# EAGLE design snappergps_1_0_0 (EAGLE 9.6.2)
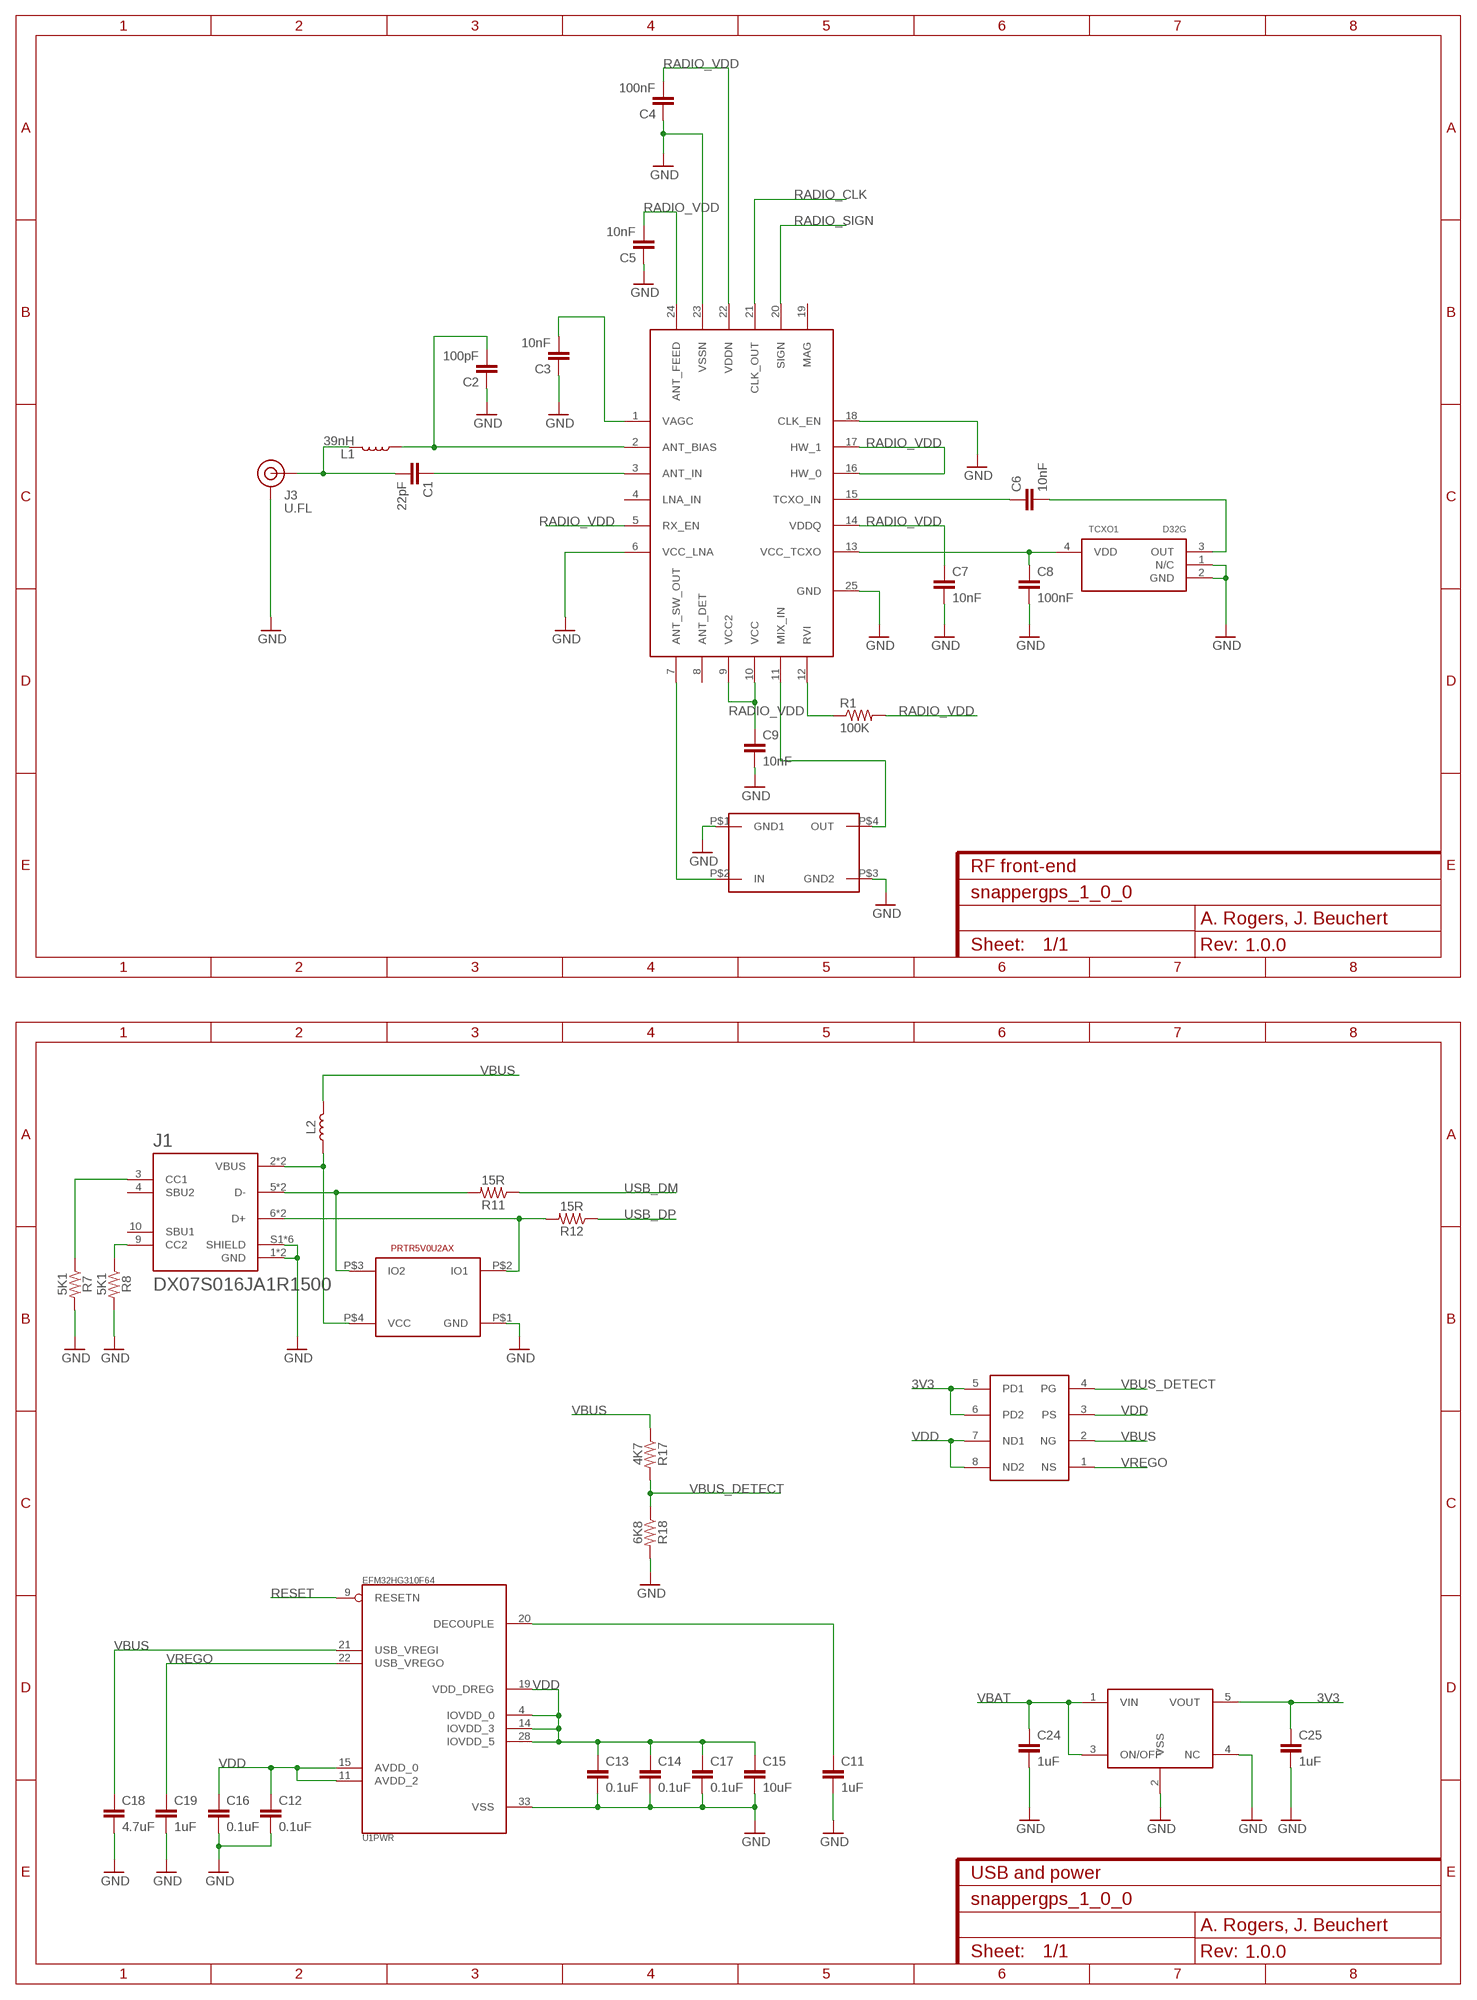
[diagram p0: schematic, sheet 1, part 1 of 2]
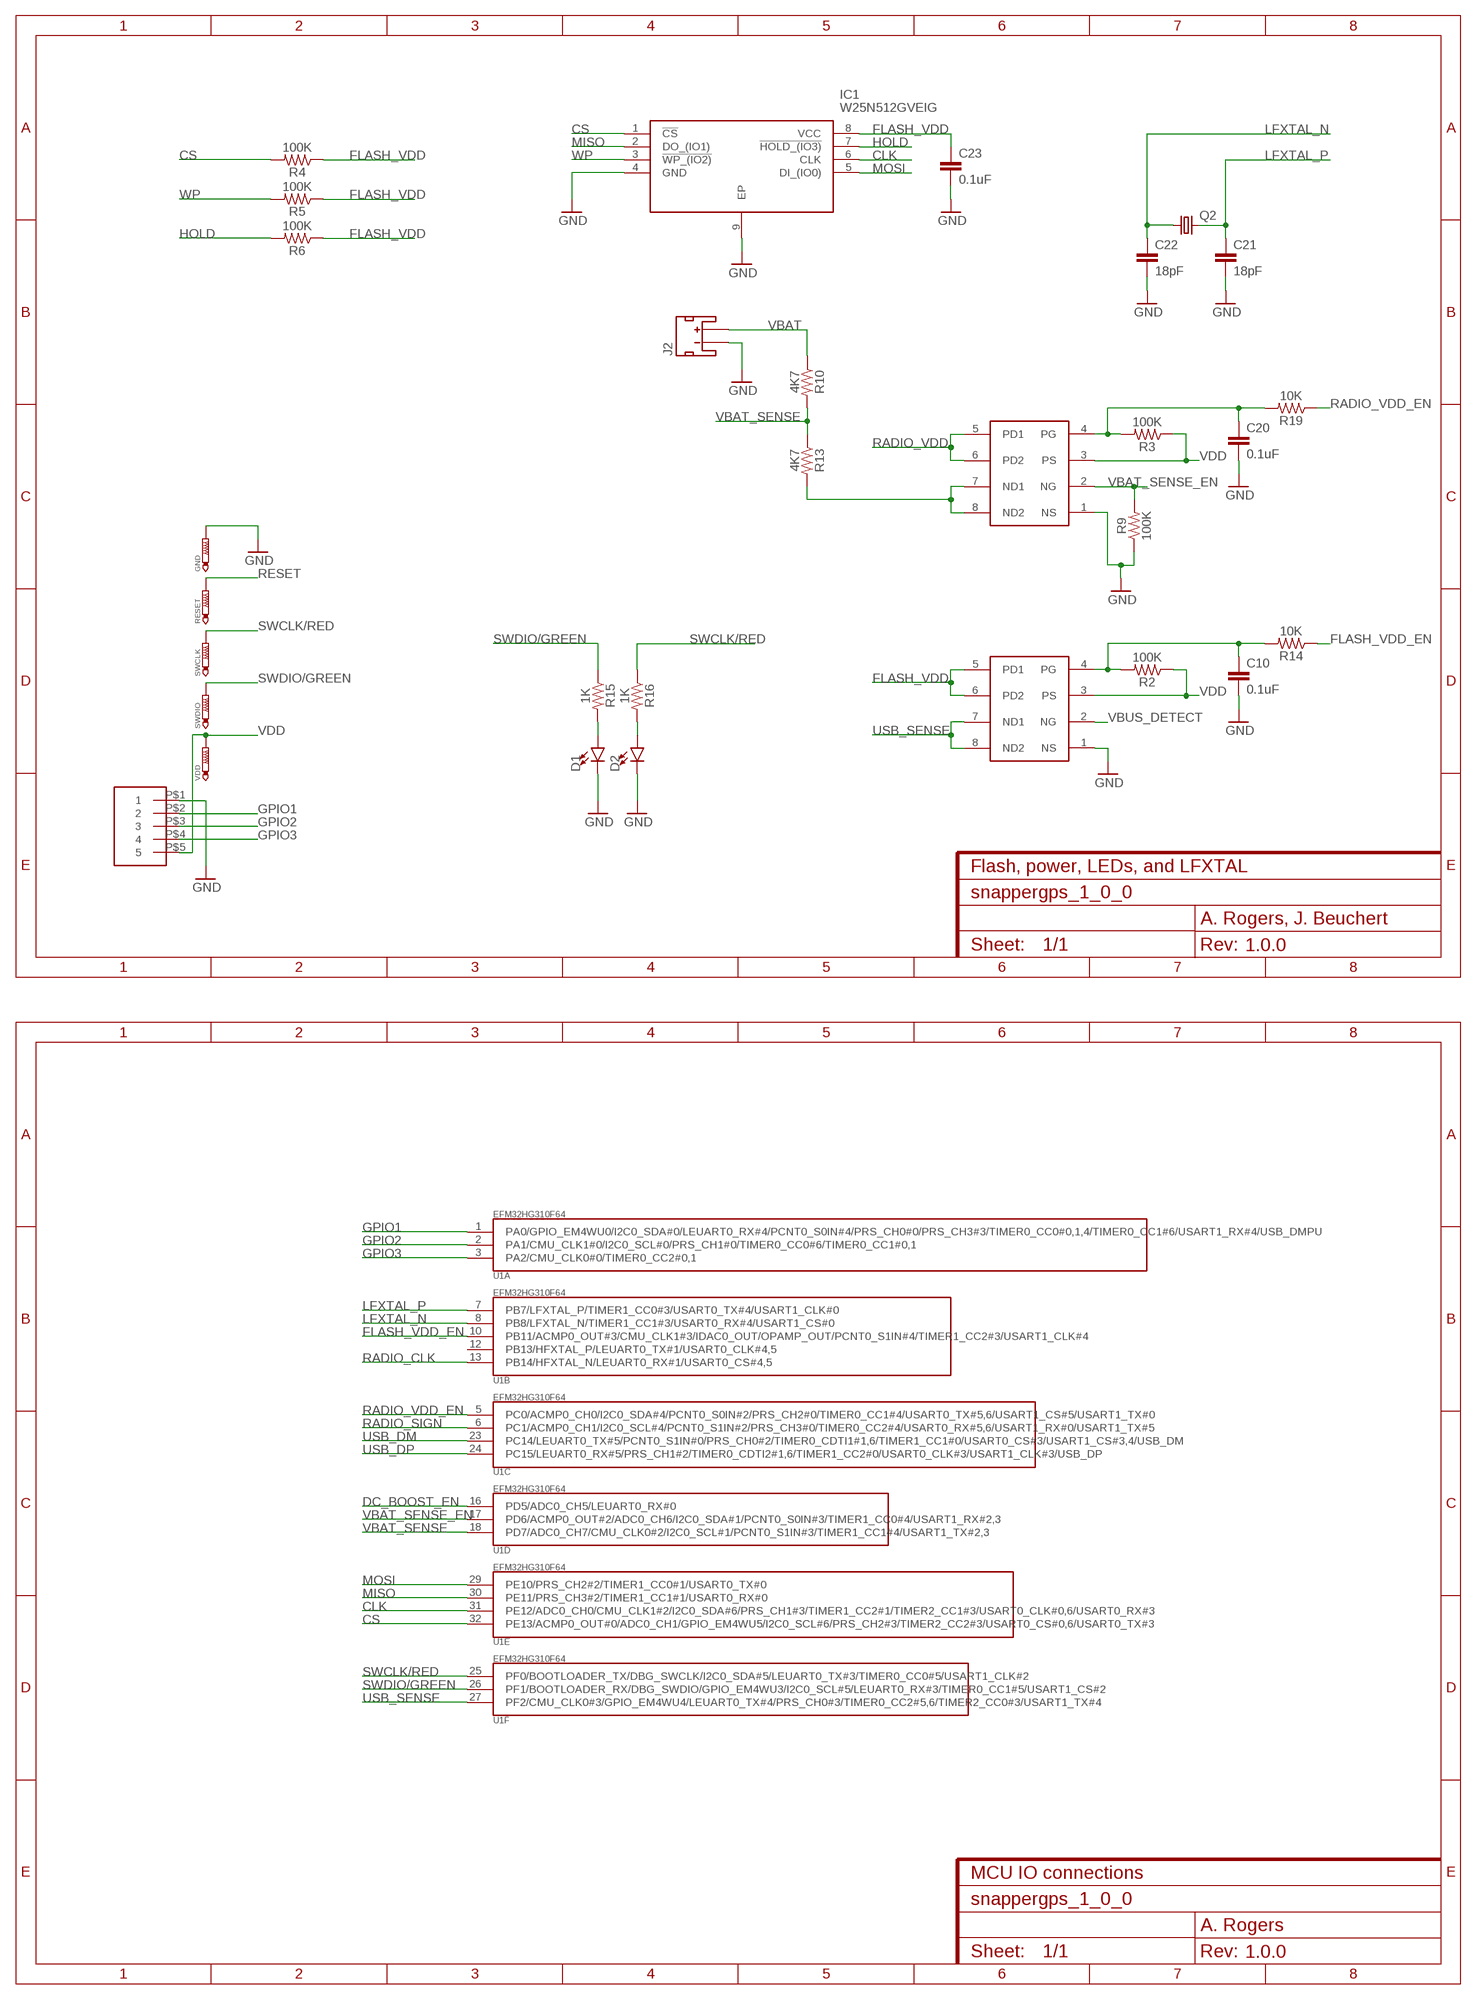
[diagram p1: schematic, sheet 1, part 2 of 2]
FRAME1 (FRAME-A4L): CNAME: RF front-end; CREVISION: 1.0.0; DESIGNER: A. Rogers, J. Beuchert; REV: 1.0.0
FRAME2 (FRAME-A4L): CNAME: Flash, power, LEDs, and LFXTAL; CREVISION: 1.0.0; DESIGNER: A. Rogers, J. Beuchert
FRAME3 (FRAME-A4L): CNAME: USB and power; CREVISION: 1.0.0; DESIGNER: A. Rogers, J. Beuchert
FRAME4 (FRAME-A4L): CNAME: MCU IO connections; CREVISION: 1.0.0; DESIGNER: A. Rogers

## Parts
C1  22pF  CAPACITOR_0402  [0402]
C2  100pF  CAPACITOR_0402  [0402]
C3  10nF  CAPACITOR_0402  [0402]
C4  100nF  CAPACITOR_0402  [0402]
C5  10nF  CAPACITOR_0402  [0402]
C6  10nF  CAPACITOR_0402  [0402]
C7  10nF  CAPACITOR_0402  [0402]
C8  100nF  CAPACITOR_0402  [0402]
C9  10nF  CAPACITOR_0402  [0402]
C10  0.1uF  CAPACITOR_0402  [0402]
C11  1uF  CAPACITOR_0603  [0603]
C12  0.1uF  CAPACITOR_0402  [0402]
C13  0.1uF  CAPACITOR_0402  [0402]
C14  0.1uF  CAPACITOR_0402  [0402]
C15  10uF  CAPACITOR_0603  [0603]
C16  0.1uF  CAPACITOR_0402  [0402]
C17  0.1uF  CAPACITOR_0402  [0402]
C18  4.7uF  CAPACITOR_0603  [0603]
C19  1uF  CAPACITOR_0603  [0603]
C20  0.1uF  CAPACITOR_0402  [0402]
C21  18pF  CAPACITOR_0402  [0402]
C22  18pF  CAPACITOR_0402  [0402]
C23  0.1uF  CAPACITOR_0402  [0402]
C24  1uF  CAPACITOR_0603  [0603]
C25  1uF  CAPACITOR_0603  [0603]
D1  LED0603  [LED-0603]
D2  LED0603  [LED-0603]
GND  PTR1B1,27  [B1,27]
IC1  W25N512GVEIG  [SON127P800X600X80-9N]
J1  DX07S016JA1R1500  [JAE_DX07S016JA1R1500]
J2  JST_2MM_MALE  [JST-2-SMD]
J3  U.FL  UFL-CONNECTOR  [U.FL]
L1  39nH  INDUCTOR  [0402]
L2  INDUCTOR  [0402]
Q1  TT8M1TRAMANDA  [AMANDA_TSST8]
Q2  CRYSTAL_JTX310  [3.2X1.5]
Q3  TT8M1TRAMANDA  [AMANDA_TSST8]
Q4  TT8M1TRAMANDA  [AMANDA_TSST8]
R1  100K  RESISTOR_0402  [0402]
R2  100K  RESISTOR_0402  [0402]
R3  100K  RESISTOR_0402  [0402]
R4  100K  RESISTOR_0402  [0402]
R5  100K  RESISTOR_0402  [0402]
R6  100K  RESISTOR_0402  [0402]
R7  5K1  RESISTOR_0402  [0402]
R8  5K1  RESISTOR_0402  [0402]
R9  100K  RESISTOR_0402  [0402]
R10  4K7  RESISTOR_0402  [0402]
R11  15R  RESISTOR_0402  [0402]
R12  15R  RESISTOR_0402  [0402]
R13  4K7  RESISTOR_0402  [0402]
R14  10K  RESISTOR_0402  [0402]
R15  1K  RESISTOR_0402  [0402]
R16  1K  RESISTOR_0402  [0402]
R17  4K7  RESISTOR_0402  [0402]
R18  6K8  RESISTOR_0402  [0402]
R19  10K  RESISTOR_0402  [0402]
RESET  PTR1B1,27  [B1,27]
SAW1  SAW_FILTER  [SAW_FILTER]
SWCLK  PTR1B1,27  [B1,27]
SWDIO  PTR1B1,27  [B1,27]
TCXO1  D32G  [D32G]
U1  EFM32HG310F64  [QFN32]
U2  RF_CIRCUIT-SE4150L  [QFN50P400X400X90-25N]
U3  TVS_DIODE-PRTR5V0U2AX  [TVS_DIODE-PRTR5V0U2AX]
U4  S-1318D33-M5T1U4  [SOT95P280X145-5N]
U5  ALEX_CONN5  [ALEX_CONN5]
VDD  PTR1B1,27  [B1,27]

## Nets
3V3: C25.1 Q4.5(PD1) Q4.6(PD2) U4.5(VOUT)
CLK: IC1.6(CLK) U1.31(E:PE12/ADC0_CH0/CMU_CLK1#2/I2C0_SDA#6/PRS_CH1#3/TIMER1_CC2#1/TIMER2_CC1#3/USART0_CLK#0,6/USART0_RX#3)
CS: IC1.1(!CS) R4.2 U1.32(E:PE13/ACMP0_OUT#0/ADC0_CH1/GPIO_EM4WU5/I2C0_SCL#6/PRS_CH2#3/TIMER2_CC2#3/USART0_CS#0,6/USART0_TX#3)
DC_BOOST_EN: U1.16(D:PD5/ADC0_CH5/LEUART0_RX#0)
FLASH_VDD: C23.1 IC1.8(VCC) Q3.5(PD1) Q3.6(PD2) R4.1 R5.1 R6.1
FLASH_VDD_EN: R14.1 U1.10(B:PB11/ACMP0_OUT#3/CMU_CLK1#3/IDAC0_OUT/OPAMP_OUT/PCNT0_S1IN#4/TIMER1_CC2#3/USART1_CLK#4)
GND: C2.1 C3.1 C4.1 C5.1 C7.2 C8.2 C9.2 C10.2 C11.2 C12.2 C13.2 C14.2 C15.2 C16.2 C17.2 C18.2 C19.2 C20.2 C21.2 C22.2 C23.2 C24.2 C25.2 D1.C D2.C GND.TP IC1.4(GND) IC1.9(EP) J1.1(GND) J1.12(GND) J1.S1(SHIELD) J1.S2(SHIELD) J1.S3(SHIELD) J1.S4(SHIELD) J1.S5(SHIELD) J1.S6(SHIELD) J2.1(-) J3.1(GND) J3.2(GND) Q1.1(NS) Q3.1(NS) R7.2 R8.2 R9.1 R18.2 SAW1.P$1(GND1) SAW1.P$3(GND2) TCXO1.1(N/C) TCXO1.2(GND) U1.33(PWR:VSS) U2.6(VCC_LNA) U2.18(CLK_EN) U2.23(VSSN) U2.25(GND) U3.P$1(GND) U4.2(VSS) U4.4(NC) U5.P$1
GPIO1: U1.1(A:PA0/GPIO_EM4WU0/I2C0_SDA#0/LEUART0_RX#4/PCNT0_S0IN#4/PRS_CH0#0/PRS_CH3#3/TIMER0_CC0#0,1,4/TIMER0_CC1#6/USART1_RX#4/USB_DMPU) U5.P$2
GPIO2: U1.2(A:PA1/CMU_CLK1#0/I2C0_SCL#0/PRS_CH1#0/TIMER0_CC0#6/TIMER0_CC1#0,1) U5.P$3
GPIO3: U1.3(A:PA2/CMU_CLK0#0/TIMER0_CC2#0,1) U5.P$4
HOLD: IC1.7(!HOLD_(IO3)) R6.2
LFXTAL_N: C22.1 Q2.1 U1.8(B:PB8/LFXTAL_N/TIMER1_CC1#3/USART0_RX#4/USART1_CS#0)
LFXTAL_P: C21.1 Q2.2 U1.7(B:PB7/LFXTAL_P/TIMER1_CC0#3/USART0_TX#4/USART1_CLK#0)
MISO: IC1.2(DO_(IO1)) U1.30(E:PE11/PRS_CH3#2/TIMER1_CC1#1/USART0_RX#0)
MIXIN [rf]: SAW1.P$4(OUT) U2.11(MIX_IN)
MOSI: IC1.5(DI_(IO0)) U1.29(E:PE10/PRS_CH2#2/TIMER1_CC0#1/USART0_TX#0)
N$1: Q1.7(ND1) Q1.8(ND2) R13.2
N$2: C20.1 Q1.4(PG) R3.2 R19.2
N$3: J1.9(CC2) R8.1
N$4: J1.3(CC1) R7.1
N$6: R1.1 U2.12(RVI)
N$8: SAW1.P$2(IN) U2.7(ANT_SW_OUT)
N$9: C8.1 TCXO1.4(VDD) U2.13(VCC_TCXO)
N$10: C6.1 U2.15(TCXO_IN)
N$11: C6.2 TCXO1.3(OUT)
N$13: C11.1 U1.20(PWR:DECOUPLE)
N$14: C10.1 Q3.4(PG) R2.2 R14.2
N$16: D1.A R15.2
N$17: D2.A R16.2
N$22: C3.2 U2.1(VAGC)
N$26: J1.2(VBUS) J1.11(VBUS) L2.1 U3.P$4(VCC)
N$31: C2.2 L1.1 U2.2(ANT_BIAS)
N$32: C1.1 U2.3(ANT_IN)
N$33: C1.2 J3.FEED(SIGNAL) L1.2
N$35: J1.6(D+) J1.7(D+) R12.2 U3.P$2(IO1)
N$36: J1.5(D-) J1.8(D-) R11.2 U3.P$3(IO2)
RADIO_CLK: U1.13(B:PB14/HFXTAL_N/LEUART0_RX#1/USART0_CS#4,5) U2.21(CLK_OUT)
RADIO_SIGN: U1.6(C:PC1/ACMP0_CH1/I2C0_SCL#4/PCNT0_S1IN#2/PRS_CH3#0/TIMER0_CC2#4/USART0_RX#5,6/USART1_RX#0/USART1_TX#5) U2.20(SIGN)
RADIO_VDD: C4.2 C5.2 C7.1 C9.1 Q1.5(PD1) Q1.6(PD2) R1.2 U2.5(RX_EN) U2.9(VCC2) U2.10(VCC) U2.14(VDDQ) U2.16(HW_0) U2.17(HW_1) U2.22(VDDN) U2.24(ANT_FEED)
RADIO_VDD_EN: R19.1 U1.5(C:PC0/ACMP0_CH0/I2C0_SDA#4/PCNT0_S0IN#2/PRS_CH2#0/TIMER0_CC1#4/USART0_TX#5,6/USART1_CS#5/USART1_TX#0)
RESET: RESET.TP U1.9(PWR:RESETN)
SWCLK/RED: R16.1 SWCLK.TP U1.25(F:PF0/BOOTLOADER_TX/DBG_SWCLK/I2C0_SDA#5/LEUART0_TX#3/TIMER0_CC0#5/USART1_CLK#2)
SWDIO/GREEN: R15.1 SWDIO.TP U1.26(F:PF1/BOOTLOADER_RX/DBG_SWDIO/GPIO_EM4WU3/I2C0_SCL#5/LEUART0_RX#3/TIMER0_CC1#5/USART1_CS#2)
USB_DM: R11.1 U1.23(C:PC14/LEUART0_TX#5/PCNT0_S1IN#0/PRS_CH0#2/TIMER0_CDTI1#1,6/TIMER1_CC1#0/USART0_CS#3/USART1_CS#3,4/USB_DM)
USB_DP: R12.1 U1.24(C:PC15/LEUART0_RX#5/PRS_CH1#2/TIMER0_CDTI2#1,6/TIMER1_CC2#0/USART0_CLK#3/USART1_CLK#3/USB_DP)
USB_SENSE: Q3.7(ND1) Q3.8(ND2) U1.27(F:PF2/CMU_CLK0#3/GPIO_EM4WU4/LEUART0_TX#4/PRS_CH0#3/TIMER0_CC2#5,6/TIMER2_CC0#3/USART1_TX#4)
VBAT: C24.1 J2.2(+) R10.1 U4.1(VIN) U4.3(ON/OFF)
VBAT_SENSE: R10.2 R13.1 U1.18(D:PD7/ADC0_CH7/CMU_CLK0#2/I2C0_SCL#1/PCNT0_S1IN#3/TIMER1_CC1#4/USART1_TX#2,3)
VBAT_SENSE_EN: Q1.2(NG) R9.2 U1.17(D:PD6/ACMP0_OUT#2/ADC0_CH6/I2C0_SDA#1/PCNT0_S0IN#3/TIMER1_CC0#4/USART1_RX#2,3)
VBUS: C18.1 L2.2 Q4.2(NG) R17.1 U1.21(PWR:USB_VREGI)
VBUS_DETECT: Q3.2(NG) Q4.4(PG) R17.2 R18.1
VDD: C12.1 C13.1 C14.1 C15.1 C16.1 C17.1 Q1.3(PS) Q3.3(PS) Q4.3(PS) Q4.7(ND1) Q4.8(ND2) R2.1 R3.1 U1.4(PWR:IOVDD_0) U1.11(PWR:AVDD_2) U1.14(PWR:IOVDD_3) U1.15(PWR:AVDD_0) U1.19(PWR:VDD_DREG) U1.28(PWR:IOVDD_5) U5.P$5 VDD.TP
VREGO: C19.1 Q4.1(NS) U1.22(PWR:USB_VREGO)
WP: IC1.3(!WP_(IO2)) R5.2
Unconnected: J1.4(SBU2) J1.10(SBU1) J2.NC1(PAD1) J2.NC2(PAD2) U1.12(B:PB13/HFXTAL_P/LEUART0_TX#1/USART0_CLK#4,5) U2.4(LNA_IN) U2.8(ANT_DET) U2.19(MAG)

## Library data of the parts
C1-C25 = bird_variant_2:CAPACITOR
D1 D2 = bird_variant_2:LED: LED (Generic) Standard schematic elements and footprints for 5mm, 3mm, 1206, and 0603 sized LEDs. Generic LEDs with no color specified.
GND RESET SWCLK SWDIO VDD = testpad:PTR1: TEST PIN
IC1 = W25N512GVEIG:W25N512GVEIG: NAND Flash 512Mb Serial NAND flash, 3V Source: Datasheet <https://www.winbond.com/resource-files/w25n512gv rev c 112118.pdf>; DESCRIPTION: NAND Flash 512Mb Serial NAND flash, 3V; HEIGHT: 0.8mm; MANUFACTURER_NAME: Winbond; MANUFACTURER_PART_NUMBER: W25N512GVEIG; MOUSER_PART_NUMBER: 454-W25N512GVEIG; MOUSER_PRICE-STOCK: https://www.mouser.co.uk/ProductDetail/Winbond/W25N512GVEIG/?qs=qSfuJ%252Bfl%2Fd5ygZJQb1vhdQ%3D%3D
J1 = DX07S016JA1R1500:DX07S016JA1R1500: USB-C (USB TYPE-C) USB 2.0 Receptacle Connector 24 (16+8 Dummy) Position Surface Mount, Right Angle; Through Hole Check prices <https://pricing.snapeda.com/parts/DX07S016JA1R1500/JAE%20Electronics/view-part?ref=eda>; AVAILABILITY: In Stock; DESCRIPTION: USB-C (USB TYPE-C) USB 2.0 Receptacle Connector 24 (16+8 Dummy) Position Surface Mount, Right Angle; Through Hole; MF: JAE Electronics; MP: DX07S016JA1R1500; PACKAGE: None; PRICE: None
J2 = SparkFun-Connectors:JST_2MM_MALE: JST 2MM MALE RA CONNECTOR Two pin, compact surface mount connector. Commonly used as a battery input connection point. We really like the solid locking feeling and high current rating on these small connectors. We use these all the time as battery connectors. Mates to single-cell LiPo batteries. Here is the connector we sell at SparkFun: JST Right Angle Connector - White <https://www.sparkfun.com/products/8612> (PRT-08612) Datasheet <http://www.sparkfun.com/datasheets/Prototyping/Connectors/JST-Horizontal.pdf> It was used on these SparkFun products: SparkFun MOSFET Power Controller <https://www.sparkfun.com/products/11214> (PRT-11214) SparkFun Battery Babysitter - LiPo Battery Manager <https://www.sparkfun.com/products/13777> (PRT-13777) And many, many others that required a lipo battery connection.; PROD_ID: CONN-11443; SF_ID: PRT-08612
J3 = bird_variant_2:UFL-CONNECTOR: SMD Antenna Connector - U.FL 2mm height, 3.0mm x 3.0mm receptacle size. SparkFun Products: SparkFun WiFi Shield - ESP8266 <https://www.sparkfun.com/products/13287> SparkFun ESP8266 Thing <https://www.sparkfun.com/products/13231> SparkFun MiniGen - Pro Mini Signal Generator Shield <https://www.sparkfun.com/products/11420>; PROD_ID: CONN-09193; SF_ID: WRL-09144
L1 L2 = bird_variant_2:INDUCTOR
Q1 Q3 Q4 = TT8M1TR-dual-np-mosfet:TT8M1TR
Q2 = bird_variant_2:CRYSTAL_JTX310: 3.2x1.5 SMD crystal
R1-R19 = bird_variant_2:RESISTOR: Generic Resistor Package
SAW1 = bird_variant_2:SAW_FILTER
TCXO1 = TCXO_test_brd_2_2:D32G
U1 = EFM32:EFM32HG310F64: EFM32HG310F64 Happy Microcontroller in 6mm x 6mm QFN32 package
U2 = bird_variant_2:RF_CIRCUIT-SE4150L
U3 = bird_variant_2:TVS_DIODE-PRTR5V0U2AX
U4 = SOT95P280X145-5N-volt:S-1318D33-M5T1U4
U5 = TestBoard_2_2_LiPo:ALEX_CONN5

## Net classes
0 default: width 0.152 mm, drill 0.305 mm, clearance 0.152 mm
2 rf: clearance 0.33 mm

## Board
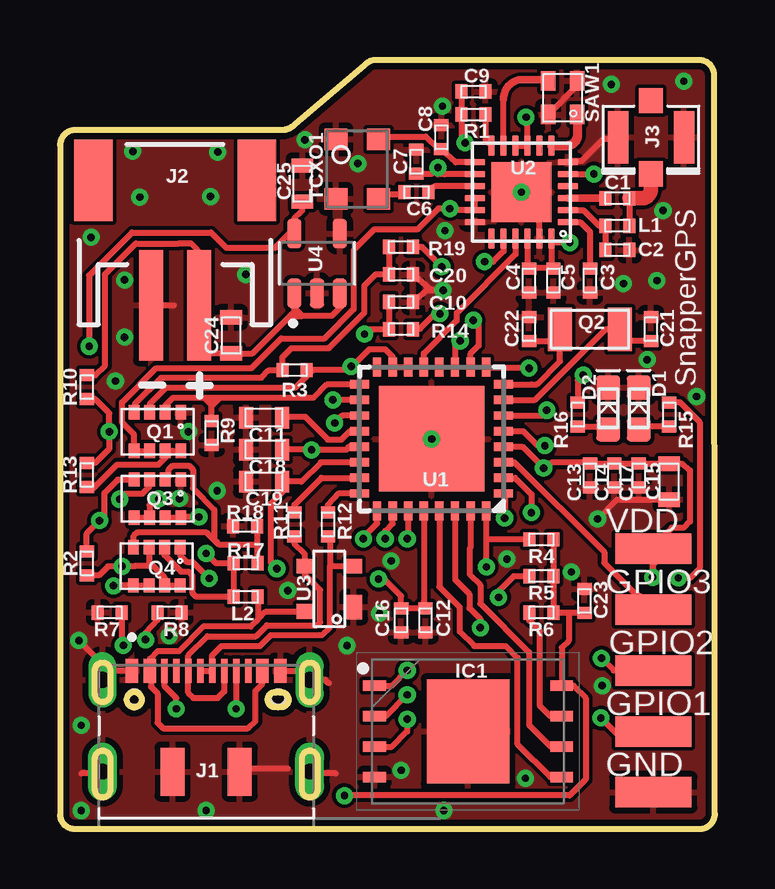
[diagram p2: board, top side]
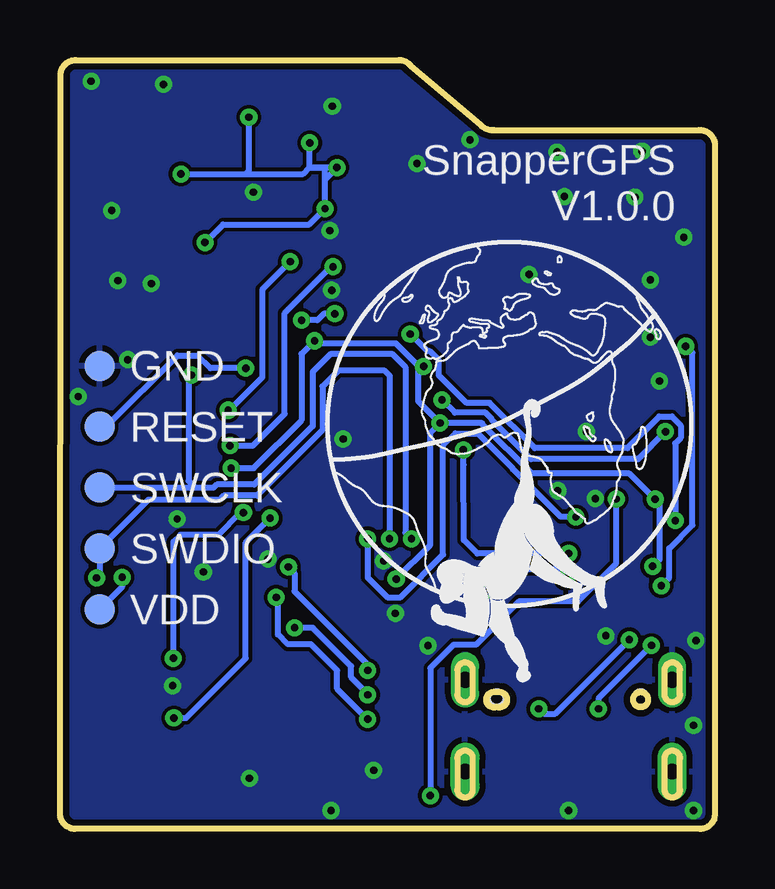
[diagram p3: board, bottom side, seen from below]

Size 27.3 x 32.05 mm. Coordinates in mm from the lower left corner, seen from the top.
Outline: 8.66,5.38 8.66,5.41 8.66,5.44 8.67,5.47 8.68,5.49 8.69,5.52 8.7,5.54 8.71,5.57 8.73,5.59 8.75,5.61 8.77,5.63 8.79,5.64 8.81,5.66 8.84,5.67 8.86,5.68 8.89,5.69 8.92,5.7 8.94,5.7 8.97,5.7 9.07,5.7 arc-9 9.12,5.7 9.22,5.7 9.25,5.7 9.28,5.7 9.3,5.69 9.33,5.68 9.35,5.67 9.38,5.66 9.4,5.64 9.42,5.63 9.44,5.61 9.46,5.59 9.48,5.57 9.49,5.54 9.51,5.52 9.52,5.49 9.53,5.47 9.53,5.44 9.54,5.41 9.54,5.38 9.54,5.36 9.53,5.33 9.53,5.3 9.52,5.28 9.51,5.25 9.49,5.23 9.48,5.2 9.46,5.18 9.44,5.16 9.42,5.14 9.4,5.13 9.38,5.11 9.35,5.1 9.33,5.09 9.3,5.08 9.28,5.08 9.25,5.07 9.22,5.07 9.12,5.07 arc-9 9.07,5.07 8.97,5.07 8.94,5.07 8.92,5.08 8.89,5.08 8.86,5.09 8.84,5.1 8.81,5.11 8.79,5.13 8.77,5.14 8.75,5.16 8.73,5.18 8.71,5.2 8.7,5.23 8.69,5.25 8.68,5.28 8.67,5.3 8.66,5.33 8.66,5.36 8.66,5.38
Outline: 10.09,5.61 10.09,6.61 10.09,6.64 10.1,6.67 10.1,6.69 10.11,6.72 10.12,6.75 10.13,6.77 10.15,6.8 10.17,6.82 10.19,6.84 10.21,6.86 10.23,6.88 10.25,6.89 10.28,6.9 10.3,6.92 10.33,6.92 10.36,6.93 10.39,6.93 10.42,6.93 10.44,6.93 10.47,6.93 10.5,6.92 10.53,6.92 10.55,6.9 10.58,6.89 10.6,6.88 10.62,6.86 10.65,6.84 10.66,6.82 10.68,6.8 10.7,6.77 10.71,6.75 10.72,6.72 10.73,6.69 10.74,6.67 10.74,6.64 10.74,6.61 10.74,5.61 10.74,5.58 10.74,5.55 10.73,5.53 10.72,5.5 10.71,5.47 10.7,5.45 10.68,5.42 10.66,5.4 10.65,5.38 10.62,5.36 10.6,5.34 10.58,5.33 10.55,5.32 10.53,5.3 10.5,5.3 10.47,5.29 10.44,5.29 10.42,5.29 10.39,5.29 10.36,5.29 10.33,5.3 10.3,5.3 10.28,5.32 10.25,5.33 10.23,5.34 10.21,5.36 10.19,5.38 10.17,5.4 10.15,5.42 10.13,5.45 10.12,5.47 10.11,5.5 10.1,5.53 10.1,5.55 10.09,5.58 10.09,5.61
Outline: 1.45,1.64 1.45,2.94 1.45,2.96 1.46,2.99 1.46,3.02 1.47,3.05 1.48,3.07 1.49,3.1 1.51,3.12 1.53,3.14 1.55,3.17 1.57,3.18 1.59,3.2 1.61,3.22 1.64,3.23 1.67,3.24 1.69,3.25 1.72,3.25 1.75,3.26 1.78,3.26 1.8,3.26 1.83,3.25 1.86,3.25 1.89,3.24 1.91,3.23 1.94,3.22 1.96,3.2 1.99,3.18 2.01,3.17 2.02,3.14 2.04,3.12 2.06,3.1 2.07,3.07 2.08,3.05 2.09,3.02 2.1,2.99 2.1,2.96 2.1,2.94 2.1,1.64 2.1,1.61 2.1,1.58 2.09,1.55 2.08,1.52 2.07,1.5 2.06,1.47 2.04,1.45 2.02,1.43 2.01,1.41 1.99,1.39 1.96,1.37 1.94,1.35 1.91,1.34 1.89,1.33 1.86,1.32 1.83,1.31 1.8,1.31 1.78,1.31 1.75,1.31 1.72,1.31 1.69,1.32 1.67,1.33 1.64,1.34 1.61,1.35 1.59,1.37 1.57,1.39 1.55,1.41 1.53,1.43 1.51,1.45 1.49,1.47 1.48,1.5 1.47,1.52 1.46,1.55 1.46,1.58 1.45,1.61 1.45,1.64
Outline: 1.45,5.61 1.45,6.61 1.45,6.64 1.46,6.67 1.46,6.69 1.47,6.72 1.48,6.75 1.49,6.77 1.51,6.8 1.53,6.82 1.55,6.84 1.57,6.86 1.59,6.88 1.61,6.89 1.64,6.9 1.67,6.92 1.69,6.92 1.72,6.93 1.75,6.93 1.78,6.93 1.8,6.93 1.83,6.93 1.86,6.92 1.89,6.92 1.91,6.9 1.94,6.89 1.96,6.88 1.99,6.86 2.01,6.84 2.02,6.82 2.04,6.8 2.06,6.77 2.07,6.75 2.08,6.72 2.09,6.69 2.1,6.67 2.1,6.64 2.1,6.61 2.1,5.61 2.1,5.58 2.1,5.55 2.09,5.53 2.08,5.5 2.07,5.47 2.06,5.45 2.04,5.42 2.02,5.4 2.01,5.38 1.99,5.36 1.96,5.34 1.94,5.33 1.91,5.32 1.89,5.3 1.86,5.3 1.83,5.29 1.8,5.29 1.78,5.29 1.75,5.29 1.72,5.29 1.69,5.3 1.67,5.3 1.64,5.32 1.61,5.33 1.59,5.34 1.57,5.36 1.55,5.38 1.53,5.4 1.51,5.42 1.49,5.45 1.48,5.47 1.47,5.5 1.46,5.53 1.46,5.55 1.45,5.58 1.45,5.61
Outline: 10.09,1.64 10.09,2.94 10.09,2.96 10.1,2.99 10.1,3.02 10.11,3.05 10.12,3.07 10.13,3.1 10.15,3.12 10.17,3.14 10.19,3.17 10.21,3.18 10.23,3.2 10.25,3.22 10.28,3.23 10.3,3.24 10.33,3.25 10.36,3.25 10.39,3.26 10.42,3.26 10.44,3.26 10.47,3.25 10.5,3.25 10.53,3.24 10.55,3.23 10.58,3.22 10.6,3.2 10.62,3.18 10.65,3.17 10.66,3.14 10.68,3.12 10.7,3.1 10.71,3.07 10.72,3.05 10.73,3.02 10.74,2.99 10.74,2.96 10.74,2.94 10.74,1.64 10.74,1.61 10.74,1.58 10.73,1.55 10.72,1.52 10.71,1.5 10.7,1.47 10.68,1.45 10.66,1.43 10.65,1.41 10.62,1.39 10.6,1.37 10.58,1.35 10.55,1.34 10.53,1.33 10.5,1.32 10.47,1.31 10.44,1.31 10.42,1.31 10.39,1.31 10.36,1.31 10.33,1.32 10.3,1.33 10.28,1.34 10.25,1.35 10.23,1.37 10.21,1.39 10.19,1.41 10.17,1.43 10.15,1.45 10.13,1.47 10.12,1.5 10.11,1.52 10.1,1.55 10.1,1.58 10.09,1.61 10.09,1.64
Outline: 2.78,5.36 arc171 3.41,5.36 3.41,5.41 arc171 2.78,5.41 2.78,5.36
Outline: 0,28.5 0,0.58 arc90 0.64,0 26.67,0 26.73,0 arc85 27.3,0.64 27.28,31.42 27.28,31.48 arc85 26.64,32.05 13.18,32.05 arc51 12.69,31.82 9.79,29.37 arc-51 9.2,29.13 0.69,29.13 0.58,29.13 arc85 0,28.5
Copper layers (1*16): Top 0.035mm / dielectric 1.5mm / Bottom 0.035mm
Design rules "default *": minimum track width 10mil, minimum drill 18mil, track to track 6mil, track to pad 6mil, pad to pad 6mil, via to via 6mil, smd to smd 6mil, copper to edge 10mil, drill to drill 8mil, minimum pad ring 10mil, minimum via ring 8mil, stop-mask expansion 4mil, vias tented up to drill 20mil, thermal gap 10mil
Holes 0.63 mm at 9.1,5.38 3.1,5.38
Holes 0.6 mm at 9.1,5.38

### Footprints (pad centres in the part's own frame; a part is rotated, then mirrored left to right if it is on the bottom)
0402 = smd 0.5 x 0.6: 1 -0.5,0; 2 0.5,0
0603 = smd 0.6 x 0.9: 1 -0.75,0; 2 0.75,0
LED-0603 = smd 1 x 1: A -0.877,0; C 0.877,0
B1,27 = smd 1.27 x 1.27: TP 0,0
SON127P800X600X80-9N = smd 0.95 x 0.45: 1 -3.9,1.905; 2 -3.9,0.635; 3 -3.9,-0.635; 4 -3.9,-1.905; 5 3.9,-1.905; 6 3.9,-0.635; 7 3.9,0.635; 8 3.9,1.905 | smd 3.45 x 4.35: 9 0,0
JAE_DX07S016JA1R1500 = smd 0.52 x 1: 1 -3.1,1.1; 2 -2.35,1.1; 11 2.35,1.1; 12 3.1,1.1 | smd 0.27 x 1: 3 -1.75,1.1; 4 -1.25,1.1; 5 -0.75,1.1; 6 -0.25,1.1; 7 0.25,1.1; 8 0.75,1.1; 9 1.25,1.1; 10 1.75,1.1 | smd 1 x 2: S1 -1.4,-3.1; S2 1.4,-3.1 | drill 0.65 long: S3 -4.32,0.725; S4 4.32,0.725 | drill 0.65 pad 1.2 long: S5 -4.32,-3.1; S6 4.32,-3.1 | hole 0.6: 3,0 | hole 0.63: 3,0; -3,0
JST-2-SMD = smd 1 x 4.6: 1 -1,-3.7; 2 1,-3.7 | smd 1.6 x 3.4: NC1 -3.4,1.5; NC2 3.4,1.5
U.FL = smd 2.2 x 0.85: 1 0,1.375; 2 0,-1.375 | smd 1.05 x 1: FEED 1.525,0; NC -1.525,0
AMANDA_TSST8 = smd 0.45 x 0.6: 1 -0.975,-0.8; 2 -0.325,-0.8; 3 0.325,-0.8; 4 0.975,-0.8; 5 0.975,0.8; 6 0.325,0.8; 7 -0.325,0.8; 8 -0.975,0.8
3.2X1.5 = smd 1 x 1.8: 1 -1.25,0; 2 1.25,0
SAW_FILTER = smd 0.8 x 0.6: P$1 -0.7,0.6; P$2 -0.7,-0.6; P$3 0.7,-0.6; P$4 0.7,0.6
D32G = smd 0.94 x 0.89: 1 0.885,-1.24; 2 0.885,1.24; 3 -0.885,1.24; 4 -0.885,-1.24
QFN32 = smd 0.8 x 0.35: 1 -3,2.275; 2 -3,1.625; 3 -3,0.975; 4 -3,0.325; 5 -3,-0.325; 6 -3,-0.975; 7 -3,-1.625; 8 -3,-2.275; 17 3,-2.275; 18 3,-1.625; 19 3,-0.975; 20 3,-0.325; 21 3,0.325; 22 3,0.975; 23 3,1.625; 24 3,2.275 | smd 0.35 x 0.8: 9 -2.275,-3; 10 -1.625,-3; 11 -0.975,-3; 12 -0.325,-3; 13 0.325,-3; 14 0.975,-3; 15 1.625,-3; 16 2.275,-3; 25 2.275,3; 26 1.625,3; 27 0.975,3; 28 0.325,3; 29 -0.325,3; 30 -0.975,3; 31 -1.625,3; 32 -2.275,3 | smd 4.4 x 4.4: 33 0,0
QFN50P400X400X90-25N = smd 0.86 x 0.27: 1 -1.935,1.25; 2 -1.935,0.75; 3 -1.935,0.25; 4 -1.935,-0.25; 5 -1.935,-0.75; 6 -1.935,-1.25; 13 1.935,-1.25; 14 1.935,-0.75; 15 1.935,-0.25; 16 1.935,0.25; 17 1.935,0.75; 18 1.935,1.25 | smd 0.27 x 0.86: 7 -1.25,-1.935; 8 -0.75,-1.935; 9 -0.25,-1.935; 10 0.25,-1.935; 11 0.75,-1.935; 12 1.25,-1.935; 19 1.25,1.935; 20 0.75,1.935; 21 0.25,1.935; 22 -0.25,1.935; 23 -0.75,1.935; 24 -1.25,1.935 | smd 2.5 x 2.5: 25 0,0
TVS_DIODE-PRTR5V0U2AX = smd 1.016 x 0.711: P$1 -0.762,-1.016 | smd 0.61 x 0.686: P$2 0.94,-1.016; P$3 0.94,1.016; P$4 -0.94,1.016
SOT95P280X145-5N = smd 1.22 x 0.6: 1 -1.245,0.95; 2 -1.245,0; 3 -1.245,-0.95; 4 1.245,-0.95; 5 1.245,0.95
ALEX_CONN5 = smd 3.175 x 1.27: P$1 0,5.08; P$2 0,2.54; P$3 0,0; P$4 0,-2.54; P$5 0,-5.08

### Placement (x,y rotation side)
C1  23.24,26.29 0 top
C2  23.24,24.13 180 top
C3  22.1,22.86 90 top
C4  19.56,22.86 90 top
C5  20.57,22.86 90 top
C6  14.86,26.54 180 top
C7  14.86,27.81 90 top
C8  15.9,28.83 90 top
C9  17.25,30.73 0 top
C10  14.22,21.97 0 top
C11  8.51,17.14 180 top
C12  15.24,8.7 270 top
C13  22.1,14.73 270 top
C14  23.11,14.73 270 top
C15  25.4,14.48 270 top
C16  14.22,8.7 270 top
C17  24.13,14.73 270 top
C18  8.51,15.81 180 top
C19  8.51,14.48 180 top
C20  14.22,23.11 0 top
C21  24.64,20.83 90 top
C22  19.56,20.83 90 top
C23  21.87,9.5 90 top
C24  7.14,20.57 90 top
C25  10.11,26.9 90 top
D1  24.13,17.53 90 top
D2  22.86,17.53 90 top
GND  25.65,19.3 0 bottom
IC1  17.02,4.06 0 top
J1  6.1,5.49 0 top
J2  4.8,25.53 0 top
J3  24.64,28.83 270 top
L1  23.24,25.15 0 top
L2  7.75,9.68 180 top
Q1  4.06,16.56 180 top
Q2  22.1,20.83 0 top
Q3  4.06,13.77 180 top
Q4  4.04,10.95 180 top
R1  17.25,29.78 180 top
R2  1.12,11.07 90 top
R3  9.78,19.13 180 top
R4  20.07,12.06 180 top
R5  20.07,10.54 180 top
R6  20.07,9.02 180 top
R7  2.08,9.02 180 top
R8  4.57,9.02 0 top
R9  6.32,16.51 90 top
R10  1.12,18.41 270 top
R11  9.78,12.7 270 top
R12  11.18,12.7 270 top
R13  1.12,14.76 270 top
R14  14.22,20.83 180 top
R15  25.4,17.27 270 top
R16  21.59,17.27 270 top
R17  7.75,11.07 0 top
R18  7.72,12.62 180 top
R19  14.22,24.26 180 top
RESET  25.65,16.76 0 bottom
SAW1  20.95,30.48 90 top
SWCLK  25.65,14.22 0 bottom
SWDIO  25.65,11.68 0 bottom
TCXO1  12.4,27.51 180 top
U1  15.49,16.26 180 top
U2  19.24,26.54 180 top
U3  11.23,10.01 90 top
U4  10.72,23.57 90 top
U5  24.74,6.6 180 top
VDD  25.65,9.14 0 bottom

### Tracks (layer width: path | path; a pad name or v marks a point on that pad's centre or on a via)
3V3  (via drill 0.3)
  Top 0.254: Q4.6 Q4.5 2.25,10.15 v2.23,10.13 | v1.22,20.12 v1.21,20.12 1.21,23.07 3.01,24.86 6.3,24.86 6.93,24.23 8.97,24.23 9.6,24.86 9.72,24.86 U4.5 9.77,25.44 10.11,25.78 C25.1
  Bottom 0.254: v1.22,20.12 0.94,19.84 0.94,12.67 1.91,11.7 1.91,10.46 v2.23,10.13
CLK
  Top 0.254: U1.31 17.12,11.74 17.09,11.71 17.09,10.59 17.53,10.16 17.53,9.4 19.56,7.37 19.56,4.34 20.47,3.43 IC1.6
CS  (via drill 0.3)
  Top 0.254: U1.32 17.78,13.24 17.78,12.06 | IC1.1 13.84,5.97 v14.48,6.6 | v17.78,10.92 17.78,12.06 | R4.2 17.78,12.06
  Bottom 0.254: v17.78,10.92 17.53,10.67 17.53,9.91 14.48,6.86 v14.48,6.6
FLASH_VDD  (via drill 0.3)
  Top 0.254: 21.21,9.02 R6.1 R5.1 R4.1 | 21.21,9.02 21.85,9.02 C23.1 | v11.86,1.38 11.87,1.4 21.26,1.4 21.92,2.06 21.92,5.46 21.41,5.97 IC1.8 20.92,7.55 21.21,7.85 21.21,9.02 | v4.12,13.75 4,13.75 3.74,13.49 Q3.6 Q3.5
  Bottom 0.254: v11.86,1.38 11.86,6.71 10.9,7.67 9.97,7.67 8.17,9.47 5.71,9.47 4.12,11.06 v4.12,13.75
FLASH_VDD_EN  (via drill 0.3)
  Top 0.254: v15.85,21.48 15.63,21.48 15.01,20.85 14.75,20.85 R14.1 | v17.23,21.2 17.45,20.99 17.45,20.14 17.12,19.82 U1.10
  Bottom 0.254: v17.23,21.2 16.57,21.2 16.3,21.48 v15.85,21.48
GND  (via drill 0.3)
  Top 0.254: SAW1.P$1 21.55,30.98 SAW1.P$3 | U2.23 19.99,27.18 U2.25 | U2.6 21.23,27.84 21.74,27.84 22.66,28.75 23.16,28.75 J3.2 | J1.1 2.27,6.59 1.78,6.1 J1.S3 1.78,6.86 v0.79,7.85 | J1.12 10.42,6.59 J1.S4 11.06,6.21 11.2,6.07 | J1.S5 1.7,2.31 0.89,2.31 | C20.2 15.48,22.45 v15.98,22.45 15.31,22.45 C10.2 | J1.S2 7.62,2.52 9.5,2.52 | J1.S6 10.49,2.31 11.51,2.31 | v22.42,12.92 23.22,13.73 C15.2 | J2.1 4.75,21.83
  other vias: 15.49,16.26 21.32,10.71 26.01,31.17 26.54,18.02 24.49,19.56 6.58,28.22 1.3,24.66 0.89,4.32 0.89,0.76 6.1,0.76 16,0.76 19.41,2.11 25.15,25.78 23.5,22.73 24.89,22.86 19.24,26.54 7.75,23.11 6.27,26.37 22.61,5.97 2.69,20.5 22.99,31.04 3.04,28.24 10.21,28.73 12.42,27.74 4.55,8.05 3.33,26.34 15.95,30.12 13.81,11.17 5.36,16.56 6.55,14.1 16.05,24.94 2.31,18.67 13.32,8.99 11.97,7.64 9.5,9.93 4.98,13.77 14.22,2.44 18.63,11.25 2.69,22.89
  pour Bottom: -0.95,33.02 28.07,33.02 28.07,-1.08 -0.95,-1.08
  pour Top: -0.51,32.51 27.56,32.51 27.56,-0.76 -0.51,-0.76
GPIO1  (via drill 0.3)
  Top 0.254: U1.1 18.55,13.98 18.54,13.97 v18.54,12.95 | v22.55,4.62 23.39,3.79 24.46,3.79 U5.P$2
  Bottom 0.254: v18.54,12.95 19.56,11.94 19.56,7.11 22.05,4.62 v22.55,4.62
GPIO2  (via drill 0.3)
  Top 0.254: U1.2 18.97,14.63 19.66,13.95 v19.66,13.18 | v22.58,7.11 23.09,6.6 U5.P$3
  Bottom 0.254: v22.58,7.11 22.58,11.96 22.28,12.26 20.71,12.26 19.79,13.18 v19.66,13.18
GPIO3
  Top 0.254: U1.3 18.95,15.28 22.69,11.54 22.69,11.09 24.05,9.73 24.16,9.73 U5.P$4
HOLD
  Top 0.254: IC1.7 20.45,4.7 19.99,5.15 19.99,8.28 19.59,8.68 19.57,8.69 R6.2
LFXTAL_N
  Top 0.254: Q2.1 20.73,20.83 20.73,20.22 20.62,20.33 C22.1 20.85,20.33 20.85,19.5 19.88,18.53 19.66,18.53 U1.8
LFXTAL_P
  Top 0.254: U1.7 19.81,17.88 22.75,20.83 Q2.2 23.45,20.49 23.61,20.33 C21.1
MISO  (via drill 0.3)
  Top 0.254: U1.30 16.47,10.39 17.07,9.79 17.07,9.21 17.53,8.75 v17.53,8.38 | v14.48,5.59 13.59,4.7 IC1.2
  Bottom 0.254: v14.48,5.59 14.48,5.63 15.16,6.32 15.16,6.78 16.76,8.38 v17.53,8.38
MIXIN
  Top 0.254: U2.11 18.49,30.43 | 20.29,31.24 arc-90 SAW1.P$4
  Top 0.305: 18.49,30.43 arc-90 19.3,31.24 20.29,31.24
MOSI
  Top 0.254: IC1.5 20.45,2.16 19.07,3.53 19.07,7.14 18.59,7.62 17.27,7.62 16.66,8.23 16.66,9.25 15.82,10.09 U1.29
N$1
  Top 0.254: Q1.7 4.68,15.76 | 4.68,15.76 Q1.8 | 4.68,15.76 4.11,15.18 2.38,15.18 1.4,14.2 1.14,14.2 R13.2
N$2
  Top 0.254: Q1.4 3.13,17.41 3.13,17.73 4.21,18.8 8.39,18.8 8.69,19.1 9.17,19.1 R3.2 9.28,19.67 9.65,20.04 11.2,20.04 11.23,20.07 11.25,20.07 12.68,21.5 12.68,22.64 13.16,23.11 C20.1 R19.2
N$3  (via drill 0.3)
  Top 0.254: J1.9 v7.34,5 | R8.1 4.07,8.72 4.07,8.7 3.57,8.16 v3.57,7.88
  Bottom 0.254: v3.57,7.88 6.65,4.8 7.14,4.8 v7.34,5
N$4  (via drill 0.3)
  Top 0.254: J1.3 4.35,5.97 4.85,5.46 v4.85,5 | v2.64,7.64 2.58,7.7 R7.1
  Bottom 0.254: v2.64,7.64 4.85,5.44 v4.85,5
N$6
  Top 0.254: U2.12 17.75,28.72 R1.1
N$8
  Top 0.254: SAW1.P$2 21.64,29.87 21.59,29.75
  Top 0.381: U2.7 21.11,28.48 arc90 21.59,28.96 21.59,29.75
N$9
  Top 0.254: U2.13 16.51,27.79 C8.1 15.75,28.37 15.26,28.87 13.24,28.87 13.24,28.79 TCXO1.4
N$10
  Top 0.254: C6.1 15.62,26.79 U2.15
N$11
  Top 0.254: TCXO1.3 13.45,26.44 14.33,26.44 C6.2
N$13
  Top 0.254: U1.20 12.48,16.57 12.08,16.57 11.74,16.23 11.17,16.23 10.23,17.17 9.41,17.17 C11.1
N$14  (via drill 0.3)
  Top 0.254: R2.2 1.12,12.32 v1.65,12.85 | Q3.4 3.08,14.55 2.4,14.55 1.85,14 1.85,13.05 v1.65,12.85 | v1.65,12.85 | v12.7,20.62 12.9,20.83 13.61,20.83 | 13.61,20.83 R14.2 | C10.1 13.72,20.94 13.61,20.83
  Bottom 0.254: v1.65,12.85 1.65,16.07 1.42,16.3 1.42,16.82 1.79,17.2 2.32,17.2 3.64,15.88 7.51,15.88 9.39,17.75 10.35,17.75 11.51,18.91 11.51,19.54 11.88,19.91 11.99,19.91 v12.7,20.62
N$16
  Top 0.254: R15.2 24.52,16.77 24.23,16.75 D1.A
N$17
  Top 0.254: R16.2 22.74,16.77 D2.A
N$22
  Top 0.254: U2.1 21.7,25.29 22.1,24.89 C3.2
N$26
  Top 0.254: J1.11 8.45,6.05 8.15,5.75 8.15,4.49 7.85,4.19 4.29,4.19 4.06,4.42 4.06,5.66 3.8,5.92 3.8,6.54 J1.2 3.75,7.1 4.07,7.42 4.96,7.42 5.98,8.43 7.95,8.43 8.26,8.74 | U3.P$4 10.19,9.04 8.56,9.04 8.26,8.74 | L2.1 8.26,9.61 8.26,8.74
N$31
  Top 0.254: U2.2 21.83,25.79 22.48,25.15 L1.1 C2.2
N$32
  Top 0.305: C1.1 22.81,26.29 U2.3
N$33
  Top 0.254: C1.2 L1.2
  Top 0.61: C1.2 24.26,26.29 arc90 24.64,26.67 J3.FEED
N$35
  Top 0.254: J1.6 J1.7 6.35,7.24 6.73,7.62 8.34,7.62 8.79,8.08 10.92,8.08 11.25,8.41 11.25,10.95 | R12.2 11.25,12.04 11.25,10.95 | U3.P$2 11.25,10.95
N$36
  Top 0.254: J1.8 6.85,5.73 6.58,5.46 5.56,5.46 5.35,5.68 J1.5 5.35,7.23 6.15,8.03 8.17,8.03 8.63,8.48 10.72,8.48 10.85,8.61 10.85,9.96 10.21,10.59 U3.P$3 10.21,11.46 9.77,11.9 9.77,12.19 R11.2
RADIO_CLK
  Top 0.254: U2.21 18.99,23.96 16.55,21.51 16.55,21.18 16.53,21.18 15.17,19.82 U1.13
RADIO_SIGN  (via drill 0.3)
  Top 0.254: U2.20 18.49,24.08 18.06,23.65 v17.7,23.65 | U1.6 20.08,17.23 v20.3,17.45
  Bottom 0.254: v17.7,23.65 18.87,22.48 18.87,18.82 20.24,17.45 v20.3,17.45
RADIO_VDD  (via drill 0.3)
  Top 0.254: v21.26,24.45 20.55,24.45 20.54,24.42 | U2.22 19.49,23.36 C4.2 19.58,23.38 20.55,23.38 C5.2 20.49,23.29 20.49,24.38 | 20.49,24.38 U2.24 20.54,24.42 | U2.16 U2.17 16.32,25.79 v16.26,25.86 15.77,25.86 14.9,24.99 13.1,24.99 12.25,24.13 12.25,21.66 11.03,20.45 9.22,20.45 7.98,19.21 4.02,19.21 2.58,17.78 2.58,16.95 3.09,16.44 Q1.5 Q1.6 | C9.1 R1.2 16.74,28.75 v16.89,28.6 | v19.43,29.67 19.49,29.61 U2.9 U2.10 | C7.1 15.49,27.3 15.62,27.43 | 20.54,24.42 20.49,24.38 | U2.5 v22.25,27.29 v22.26,27.3 | 15.62,27.43 15.76,27.29 16.04,27.29 | U2.14 16.04,27.29 | 15.62,27.43 v15.76,27.57 16.04,27.29
  Bottom 0.254: 16.26,27.07 v16.26,25.86 16.92,25.2 20.51,25.2 v21.26,24.45 | 16.26,27.07 16.26,27.56 16.92,27.56 17.18,27.3 19.56,27.3 | 16.26,27.07 v15.76,27.57 16.89,27.57 v16.89,28.6 | v22.26,27.3 19.56,27.3 | v19.43,29.67 19.43,27.43 19.56,27.3
RADIO_VDD_EN  (via drill 0.3)
  Top 0.254: U1.5 19.31,16.58 19.91,15.98 v20.22,15.98 | v15.92,23.43 15.1,24.25 15.09,24.26 R19.1
  Bottom 0.254: v20.22,15.98 19.25,15.98 17.93,17.3 17.93,21.5 15.99,23.43 v15.92,23.43
RESET  (via drill 0.3)
  Top 0.254: U1.9 17.82,19.2 v19.55,19.2 v19.56,19.2
  Bottom 0.254: RESET.TP 25.38,16.76 22.4,19.74 21.57,19.74 21.03,19.2 v19.56,19.2
SWCLK/RED  (via drill 0.3)
  Top 0.254: v21.82,18.92 21.59,18.69 R16.1 | v12.65,12.09 12.65,12.17 13.22,12.74 U1.25
  Bottom 0.254: v12.65,12.09 12.9,12.34 12.9,19.25 13.46,19.81 16,19.81 16.76,19.05 16.76,16.79 19.2,14.35 20.77,14.35 20.9,14.22 21.67,14.22 | SWCLK.TP 21.67,14.22 | v21.82,18.92 21.95,18.8 21.95,14.5 21.67,14.22
SWDIO/GREEN  (via drill 0.3)
  Top 0.254: v13.56,12.09 13.56,12.42 13.87,12.73 U1.26 | R15.1 25.86,17.78 26.68,16.96 26.68,10.85 26.29,10.46 v25.78,10.46
  Bottom 0.254: v13.56,12.09 13.56,18.9 13.77,19.1 15.7,19.1 16.36,18.44 16.36,16.62 19.09,13.89 20.48,13.89 20.66,13.72 23.62,13.72 SWDIO.TP 25.65,10.59 v25.78,10.46
USB_DM
  Top 0.254: R11.1 9.78,13.5 10.91,14.63 U1.23
USB_DP
  Top 0.254: U1.24 11.61,13.98 11.18,13.5 R12.1
USB_SENSE  (via drill 0.3)
  Top 0.254: U1.27 14.52,12.15 v14.48,12.09 | v5.78,12.99 v5.79,13.01 5.08,13.01 Q3.8 Q3.7
  Bottom 0.254: v14.48,12.09 14.48,10.47 13.66,9.65 13.11,9.65 11.33,11.43 11.33,15.98 10.82,16.48 9.88,16.48 8.42,15.03 8.42,15 6.43,13.01 v5.79,13.01
VBAT
  Top 0.254: R10.1 1.47,18.91 1.88,19.32 1.88,23.12 3.16,24.41 4.95,24.41 5.46,24.41 5.99,23.88 5.99,21.84 5.8,21.64 | 5.8,21.64 5.8,19.89 5.87,19.82 C24.1 8.02,19.82 9.58,21.39 9.65,21.39 | 5.8,21.64 J2.2 | 10.09,21.39 11.33,21.39 11.73,21.79 11.73,22.27 U4.3 | 10.09,21.39 10.09,21.4 9.85,21.64 | 9.85,21.64 9.77,21.72 U4.1 9.77,21.43 9.73,21.39 | 9.65,21.39 9.73,21.39 | 9.73,21.39 10.09,21.39 | 9.85,21.64 9.65,21.45 9.65,21.39
VBAT_SENSE  (via drill 0.3)
  Top 0.254: v11.38,17.88 | v11.38,17.88 U1.18 | R10.2 1.47,17.91 2.06,17.33 v2.06,16.56 2.06,15.84 1.47,15.26 R13.1
  Bottom 0.254: v11.38,17.88 10.85,17.35 9.56,17.35 9.3,17.09 9.3,17.05 7.66,15.42 3.2,15.42 v2.06,16.56
VBAT_SENSE_EN
  Top 0.254: Q1.2 4.39,17.66 4.7,17.97 6.04,17.97 6.04,17.96 | R9.2 6.33,17.63 6.35,17.65 | 6.35,17.65 6.04,17.96 | U1.17 12.48,18.52 11.12,18.52 10.56,17.96 6.66,17.96 | 6.35,17.65 6.66,17.96 | 6.66,17.96 6.04,17.96
VBUS  (via drill 0.3)
  Top 0.254: U1.21 12.06,15.93 11.94,15.8 v10.49,15.8 10.48,15.81 C18.1 | Q4.2 4.36,11.41 5.04,10.73 5.35,10.73 5.52,10.56 5.52,9.84 5.68,9.68 L2.2 R17.1 6.5,11.07 v6.1,11.48
  Bottom 0.254: v10.49,15.8 10.47,15.78 10.47,15.18 10.46,12.04 9.9,11.48 v6.1,11.48
VBUS_DETECT
  Top 0.254: Q4.4 3.08,11.79 3.08,12.22 3.21,12.36 6.12,12.36 6.53,11.94 | 6.53,11.94 6.53,11.96 6.44,12.06 6.44,13.31 5.54,14.2 5.54,14.98 5.38,15.15 4.7,15.15 4.54,14.98 4.54,14.71 Q3.2 | R18.1 8.22,11.86 | 8.22,11.86 8.22,11.1 R17.2 | 8.22,11.86 6.61,11.86 6.53,11.94
VDD  (via drill 0.3)
  Top 0.254: U1.19 11.77,17.23 v11.46,16.92 | U1.14 U1.15 13.87,19.68 13.56,19.99 12.88,19.99 12.16,19.26 v12.14,19.28 | U1.4 19.27,15.93 v20.17,15.04 20.27,15.04 20.5,15.27 21.98,15.27 C13.1 C14.1 C17.1 C15.1 25.94,15.23 26.27,14.94 26.27,12.81 26.01,12.55 25.5,12.55 25.22,12.27 25.22,11.51 24.71,11 v24.71,10.49 24.74,10.52 U5.P$5 | U1.11 16.47,20.13 v16.69,20.34 | 12.17,19.28 v12.14,19.28 | U1.28 15.17,9.47 arc45 C12.1 C16.1 14.22,9.7 13.51,10.41 v13.28,10.41 | Q4.8 Q4.7 4.36,10.49 3.88,10.97 3.68,10.97 | v12.14,19.28 11.99,19.13 10.55,19.13 | Q3.3 3.74,14.28 3.43,13.97 2.72,13.97 v2.49,13.74 | Q1.3 3.76,17.38 3.76,17.73 4.42,18.39 9.82,18.39 10.55,19.13 | 3.68,10.97 3.15,10.97 3.15,10.96 2.61,10.96 v2.59,10.95 2,10.95 1.63,10.57 1.6,10.57 R2.1 | Q4.3 3.71,11 3.68,10.97 | R3.1 10.55,19.13
  Bottom 0.254: v11.46,16.92 11.89,16.48 11.89,11.81 v13.28,10.41 | v20.17,15.04 19.23,15.04 17.23,17.03 17.23,19.8 v16.69,20.34 16.59,20.24 13.31,20.24 12.34,19.28 12.17,19.28 | v11.46,16.92 12.37,17.83 12.37,19.3 12.22,19.15 12.04,19.15 12.17,19.28 | v11.46,16.92 9.7,16.92 9.7,16.88 7.63,14.81 3.56,14.81 v2.49,13.74 2.31,13.56 2.31,11.23 v2.59,10.95 | v24.71,10.49 24.71,10.08 VDD.TP | v12.14,19.28 12.17,19.28
VREGO  (via drill 0.3)
  Top 0.254: U1.22 10.88,15.28 10.07,14.48 C19.1 9.38,14.15 8.79,13.56 8.79,11.1 v9.04,10.85 | Q4.1 5.01,11.39 5.27,11.13 5.52,11.13 v6.22,10.44
  Bottom 0.254: v6.22,10.44 6.63,10.85 v9.04,10.85
WP  (via drill 0.3)
  Top 0.254: IC1.3 13.84,3.43 14.48,4.06 v14.48,4.57 | R5.2 18.92,10.54 18.29,9.91 v18.29,9.65
  Bottom 0.254: v14.48,4.57 15.75,5.84 15.75,6.6 16.84,7.7 17.81,7.7 18.21,8.1 18.21,9.58 v18.29,9.65

### Text on the board
tPlace: SnapperGPS | VDD | GPIO3 | GPIO2 | GPIO1 | GND
bPlace: SnapperGPS | V1.0.0